# Altium schematic sheet Page 1.SchDoc: Инвертор напряжения 24-380-230В
size 1188 x 840 mm; CompanyName: Nordic Energy; Address1: Address1; Address2: Address2; Address3: Address3; Address4: Address4; DocumentNumber: НЭС.185014.2017-5.1; SheetNumber: 1; SheetTotal: 3; Scale: 1:1; Title2str: номинальной мощностью 2000 Вт; DocumentType: Схема электрическая принципиальная; FirstReferrence: НЭС.185014.2017-5.1
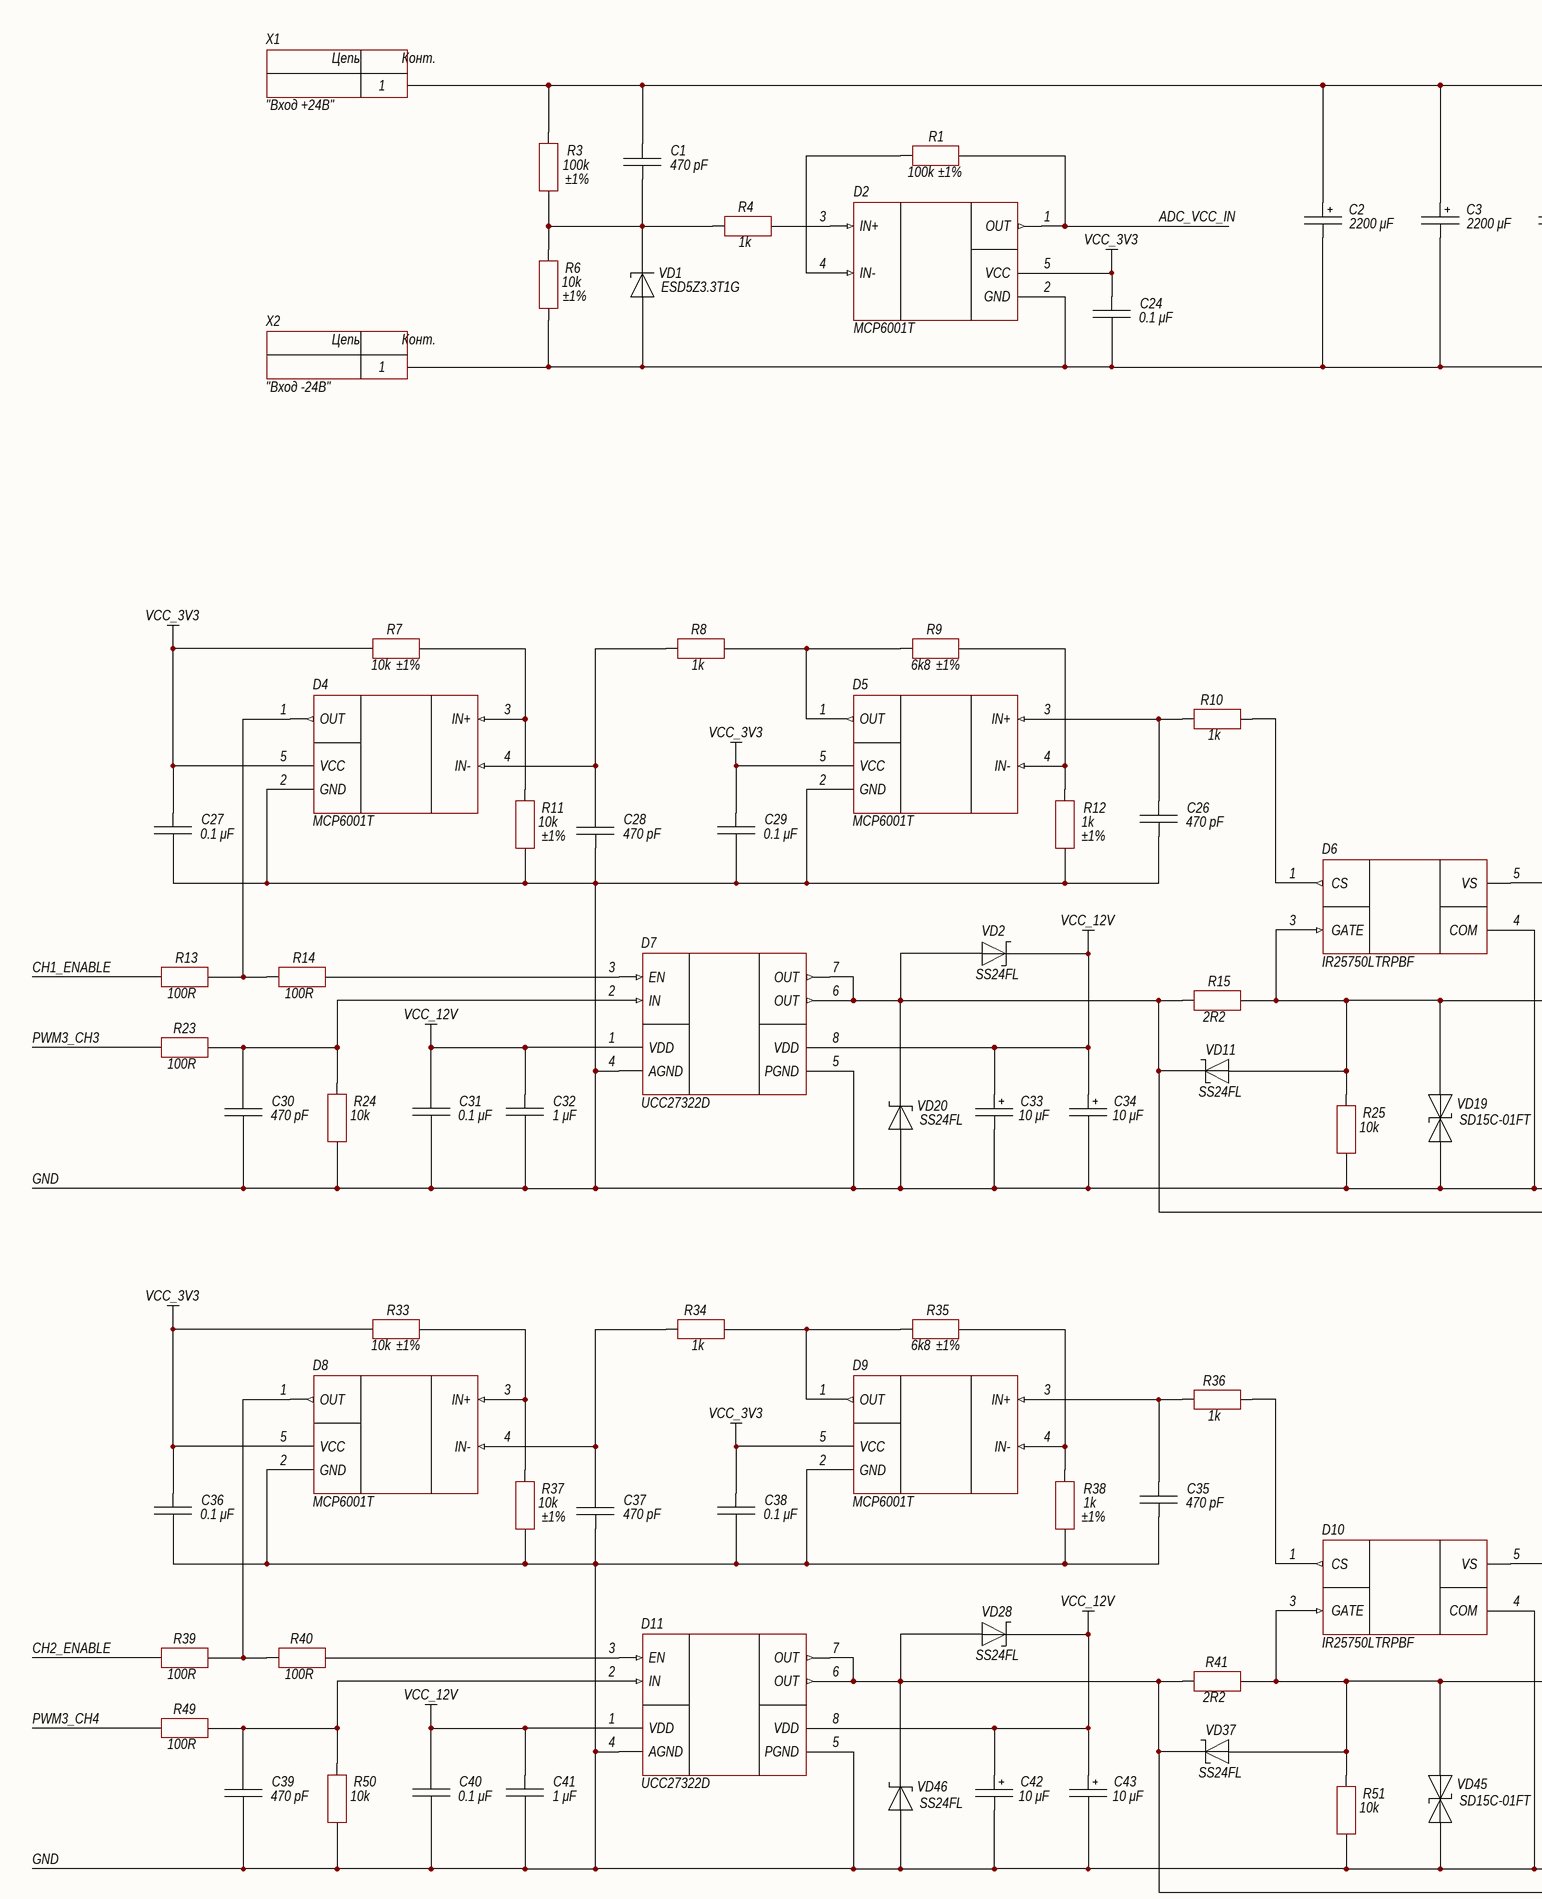
[diagram p0: Page 1.SchDoc, top left]
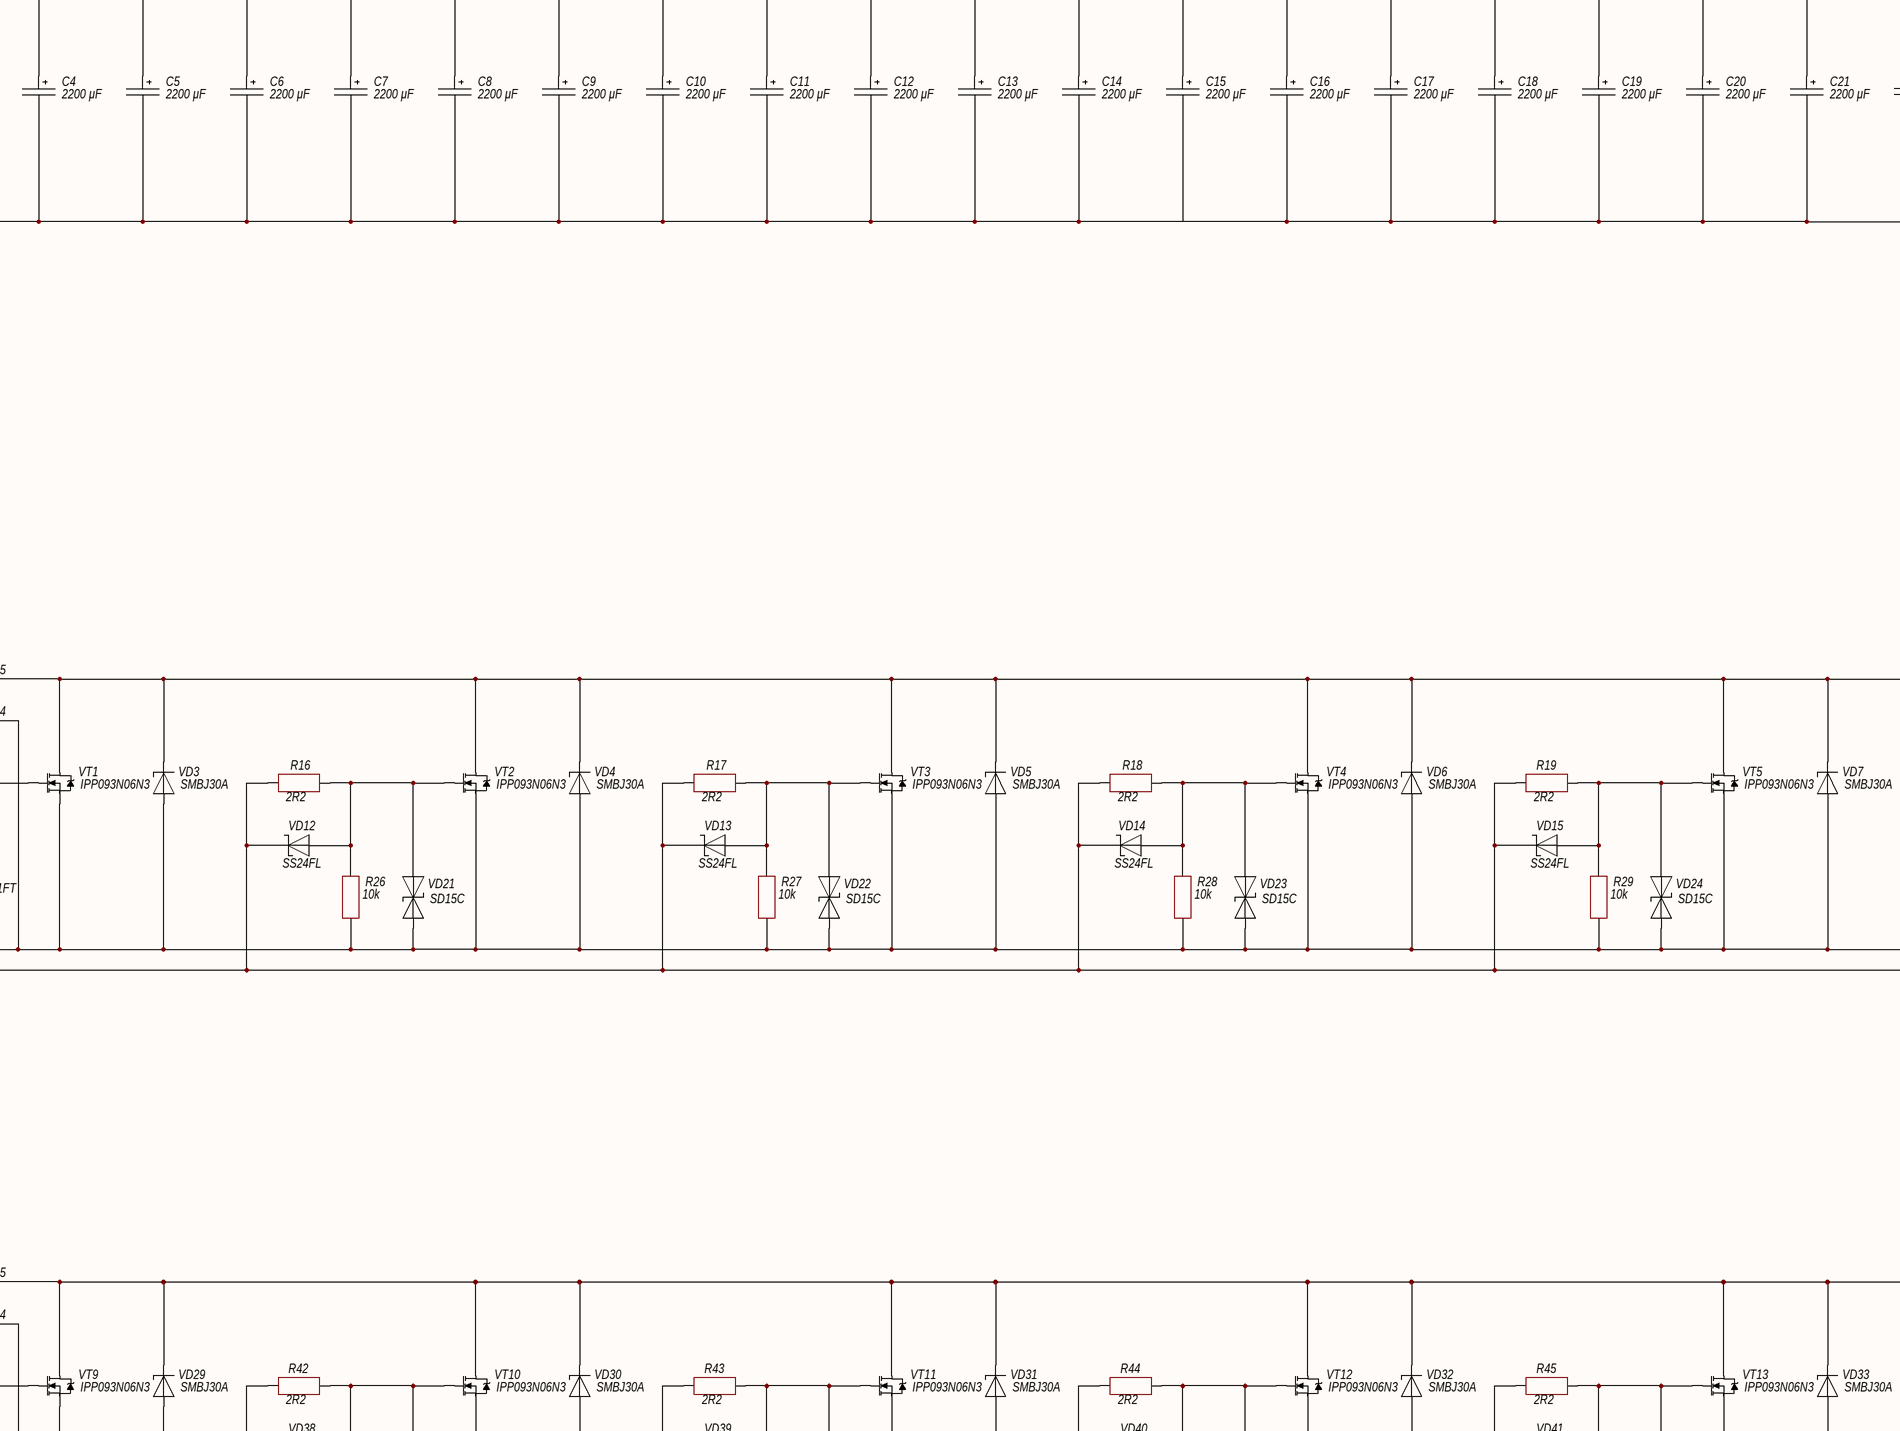
[diagram p1: Page 1.SchDoc, top middle]
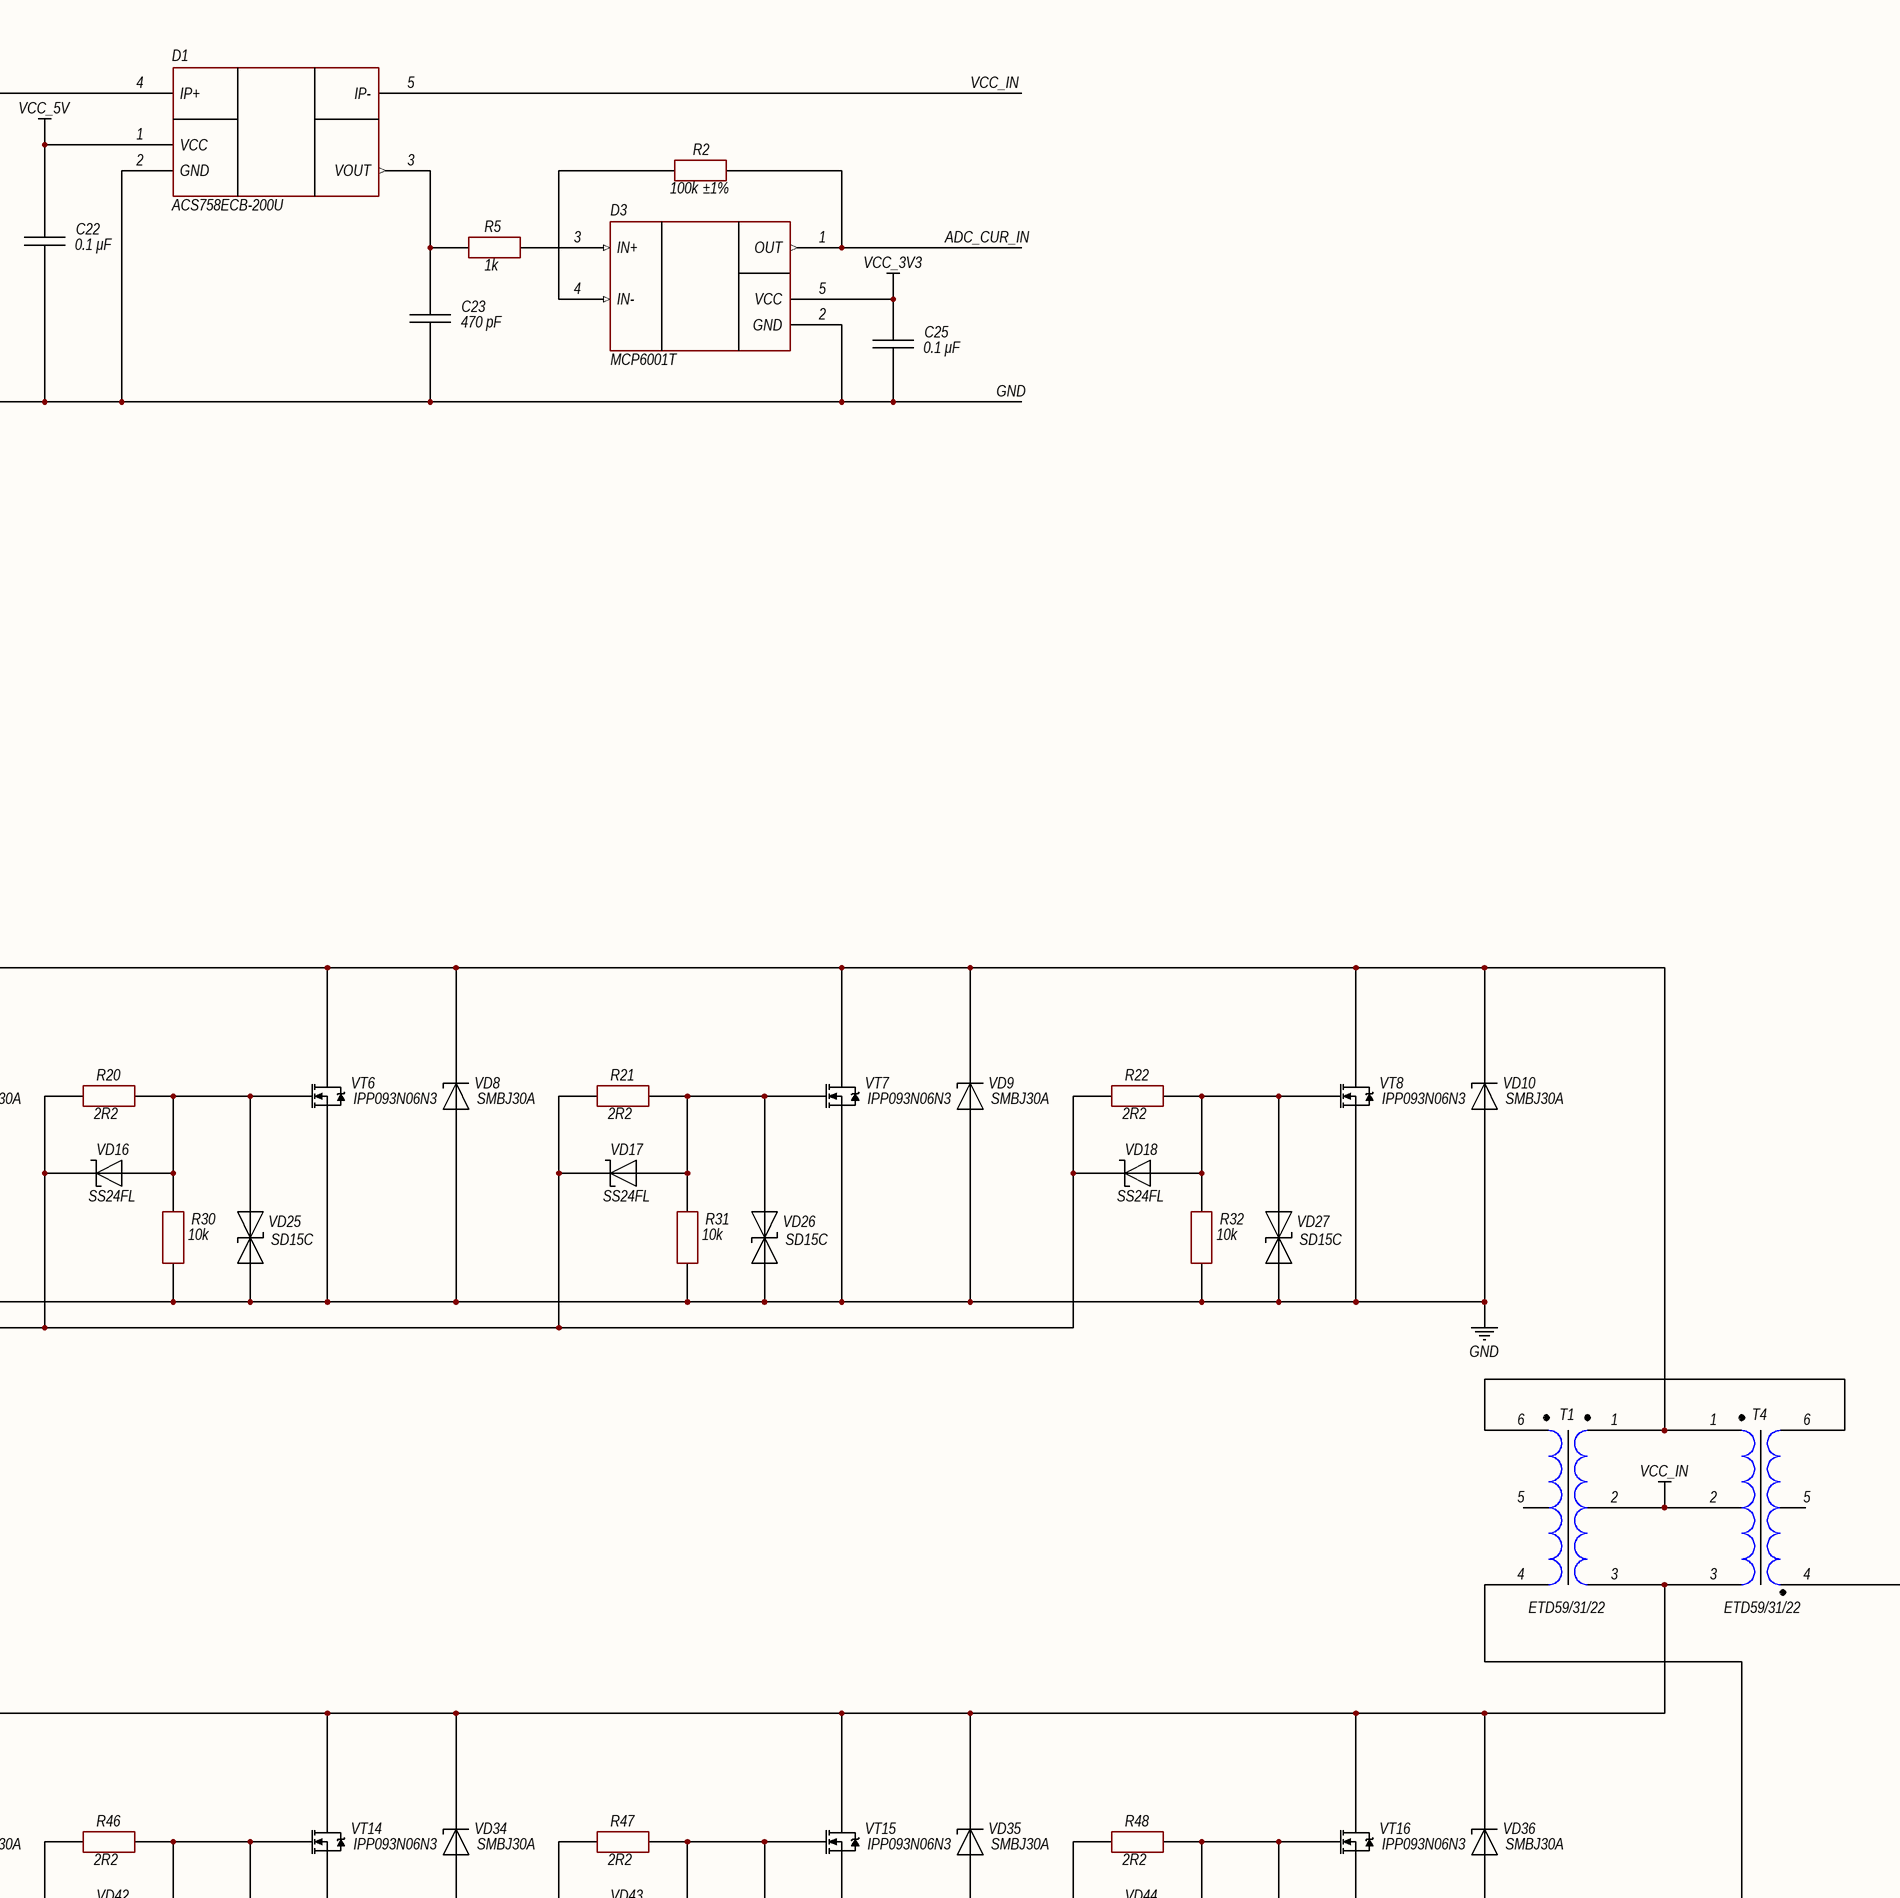
[diagram p2: Page 1.SchDoc, top right]
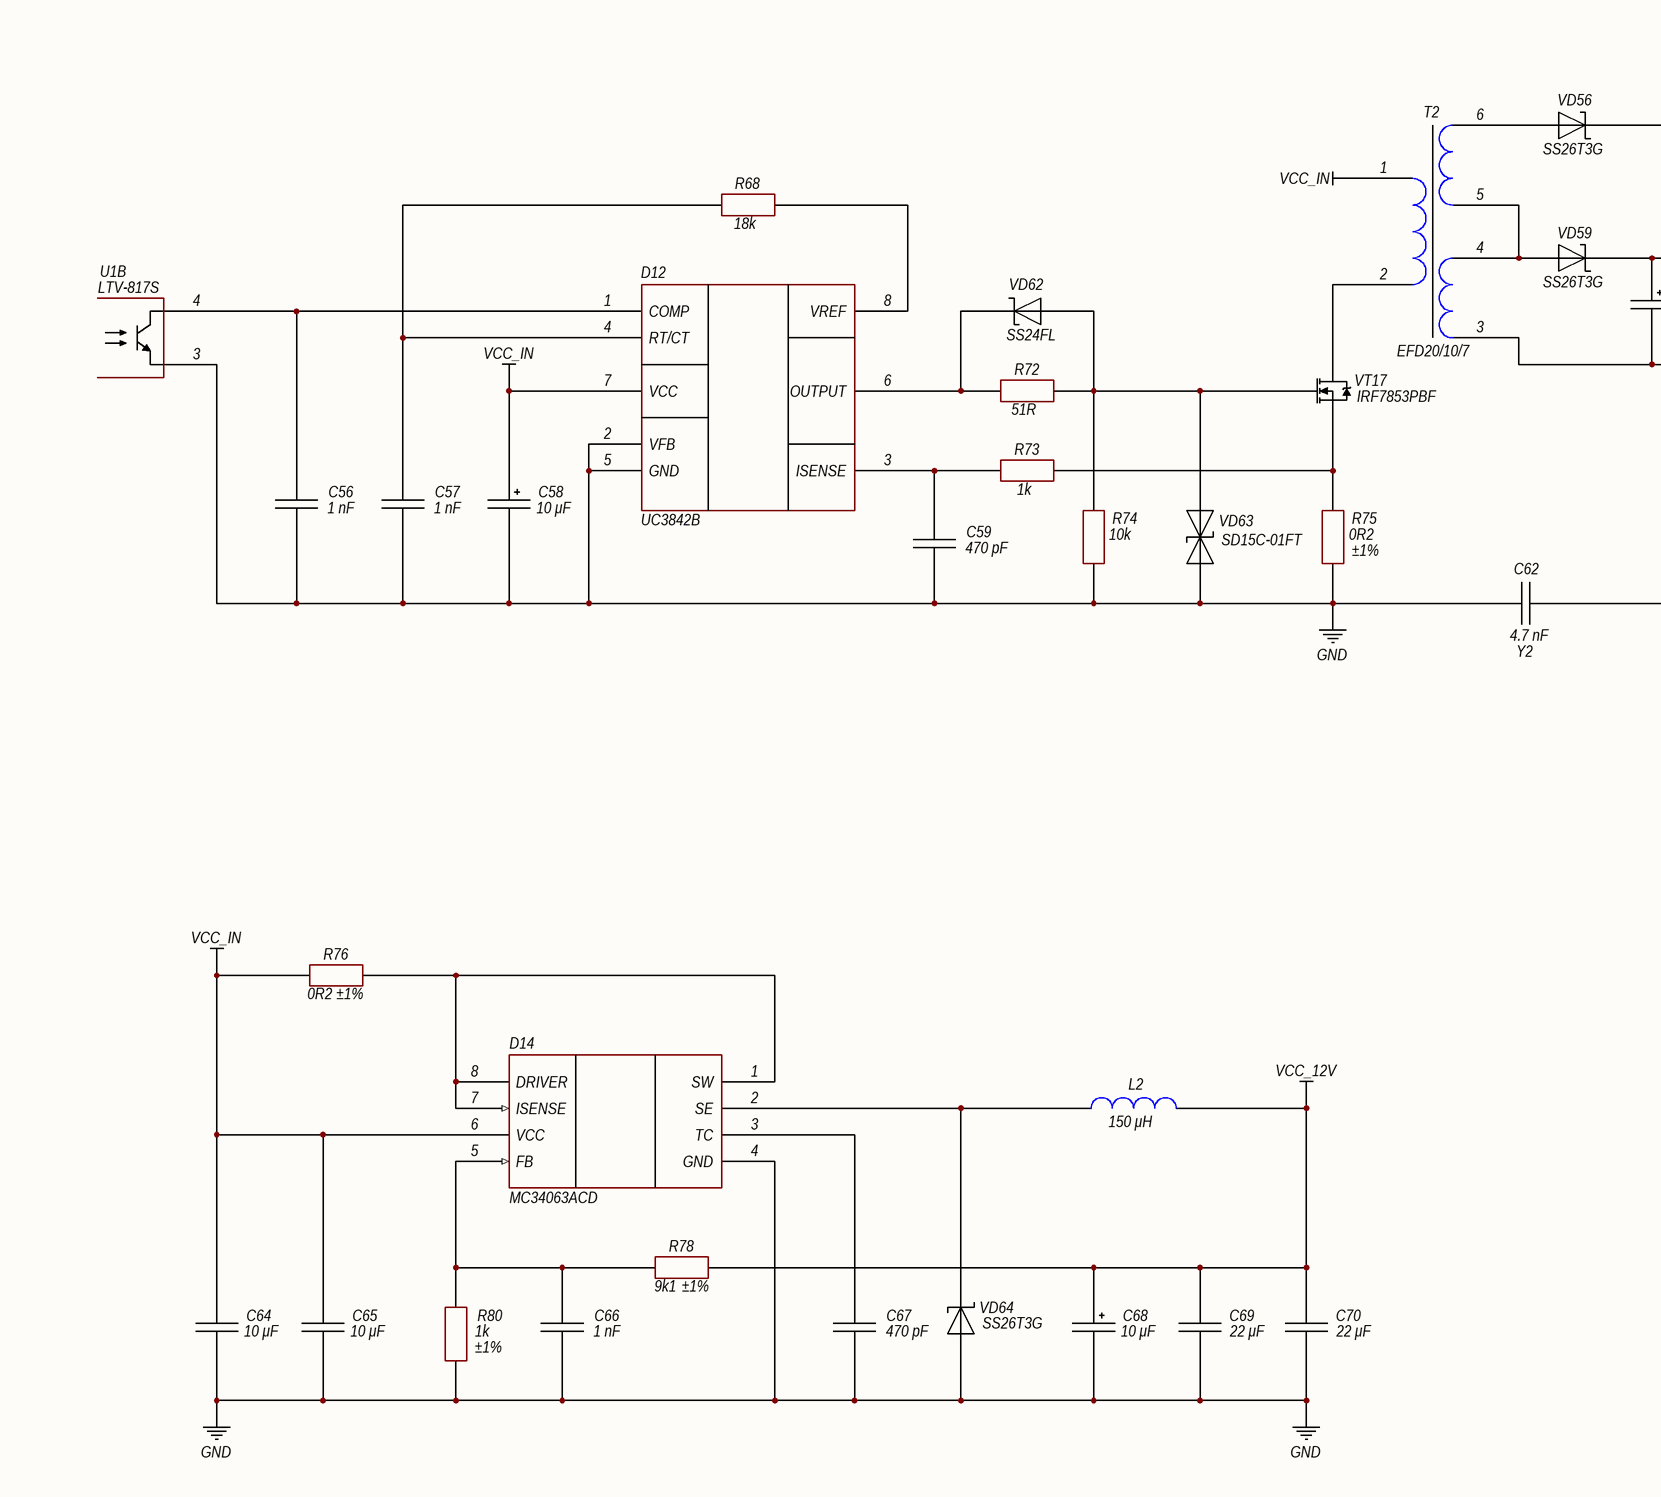
[diagram p3: Page 1.SchDoc, bottom left]
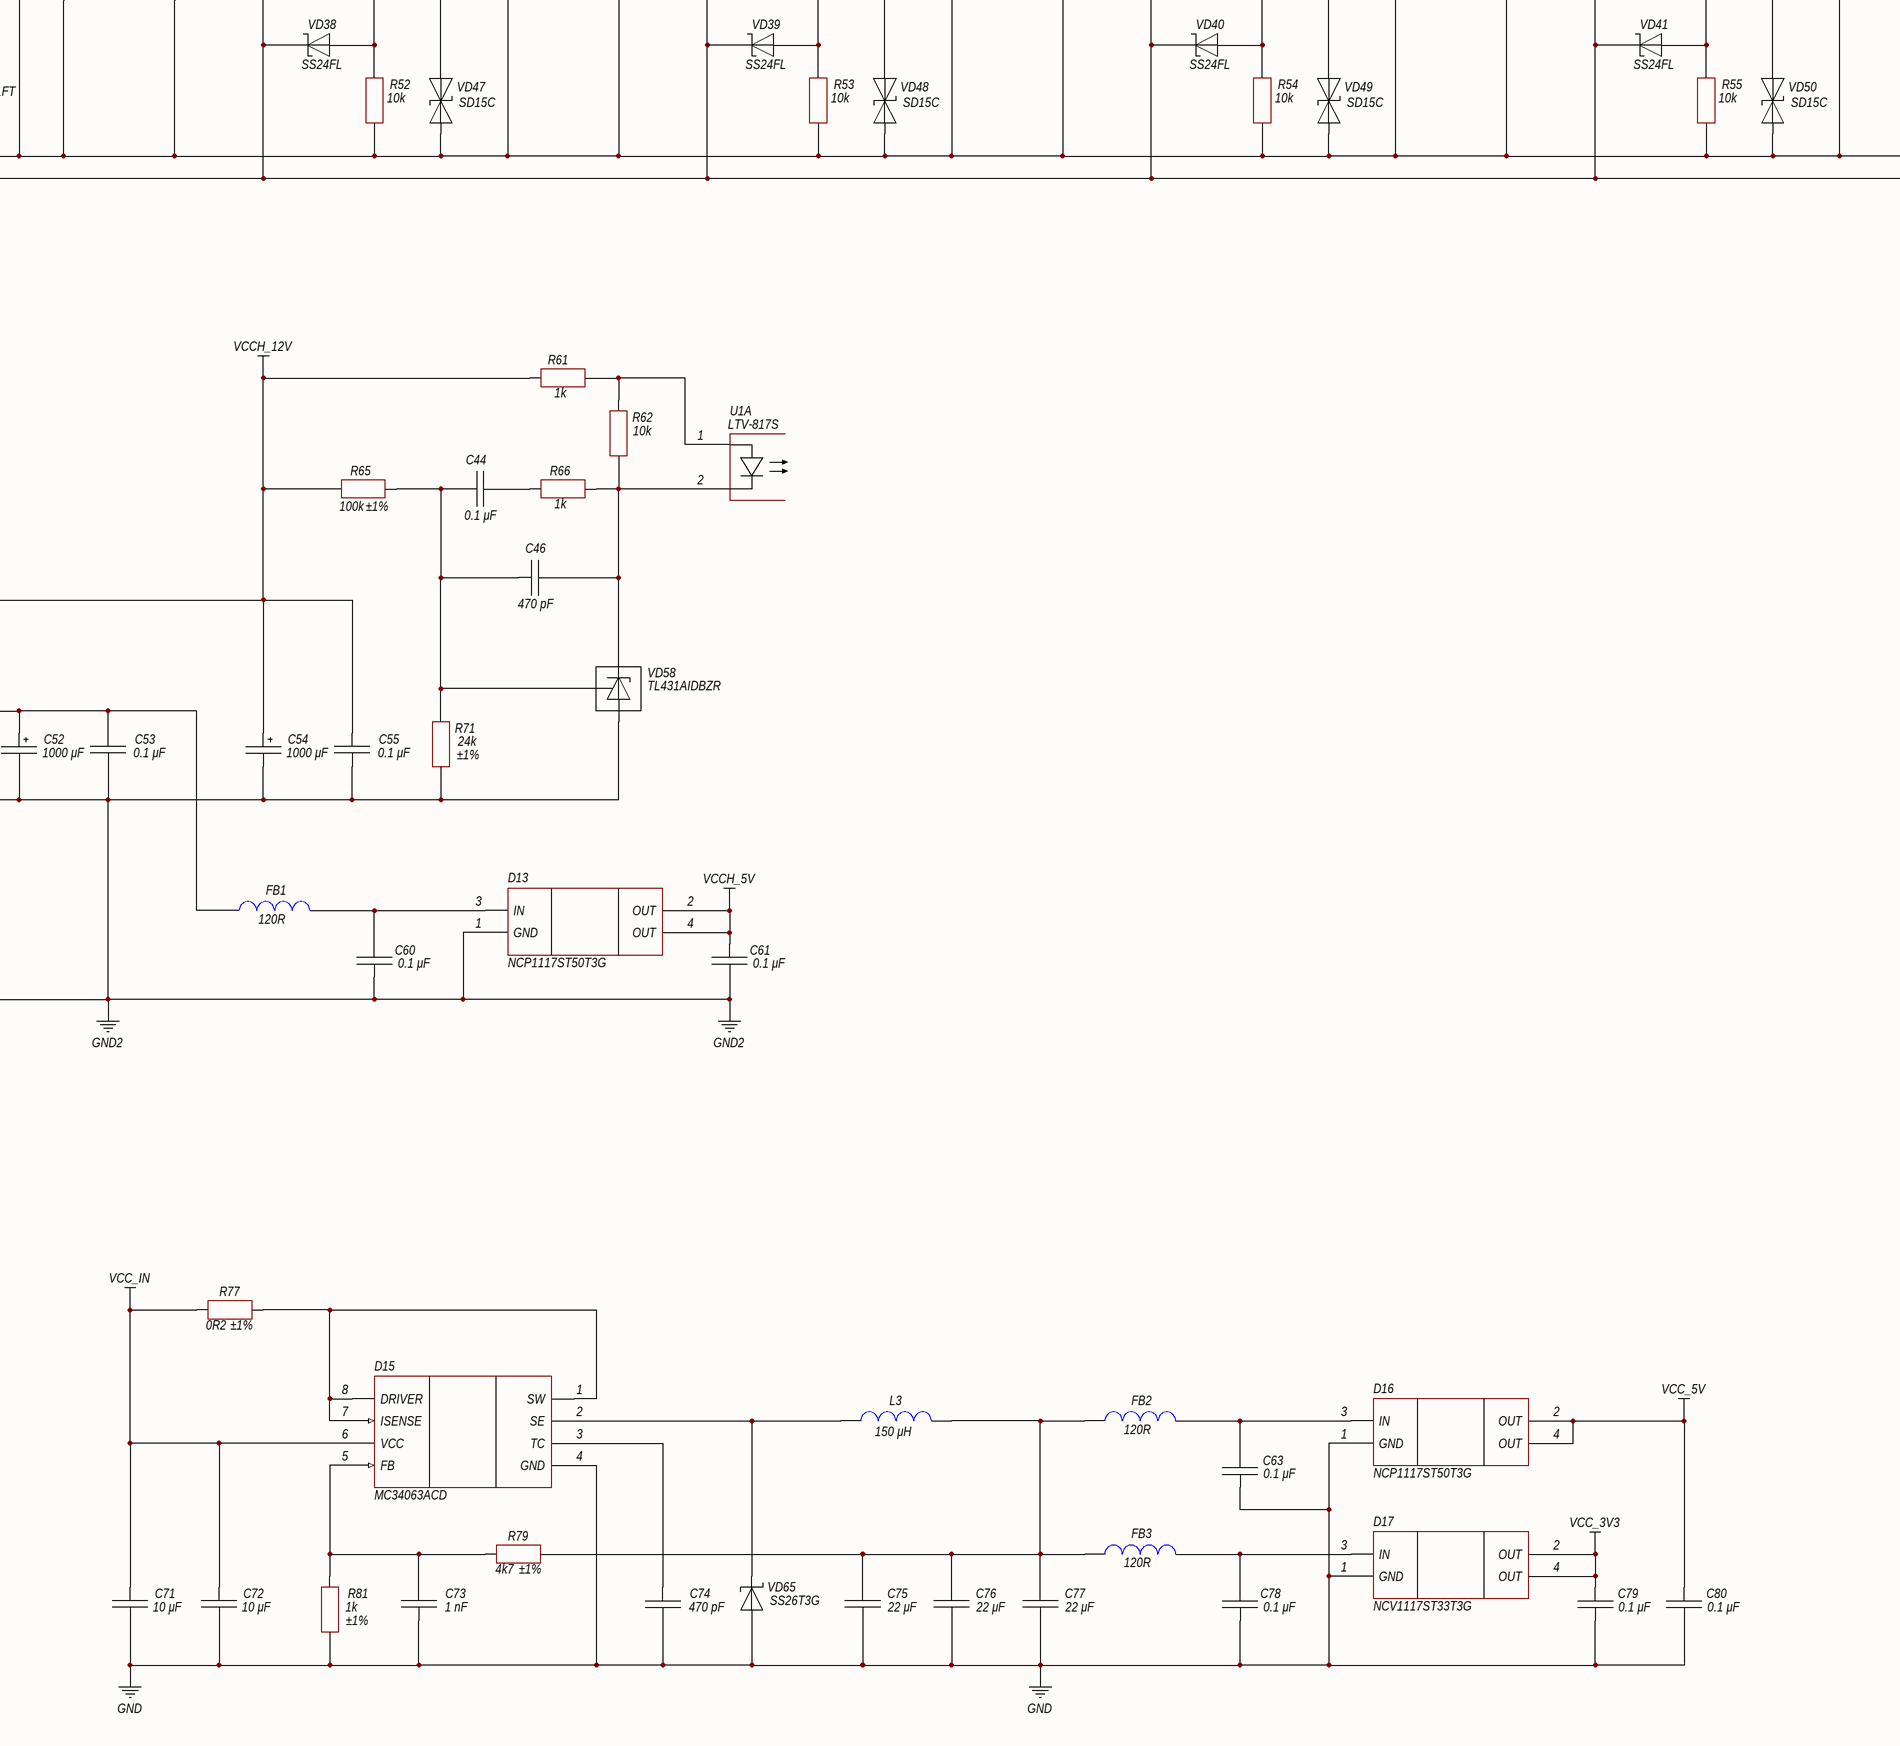
[diagram p4: Page 1.SchDoc, bottom middle]
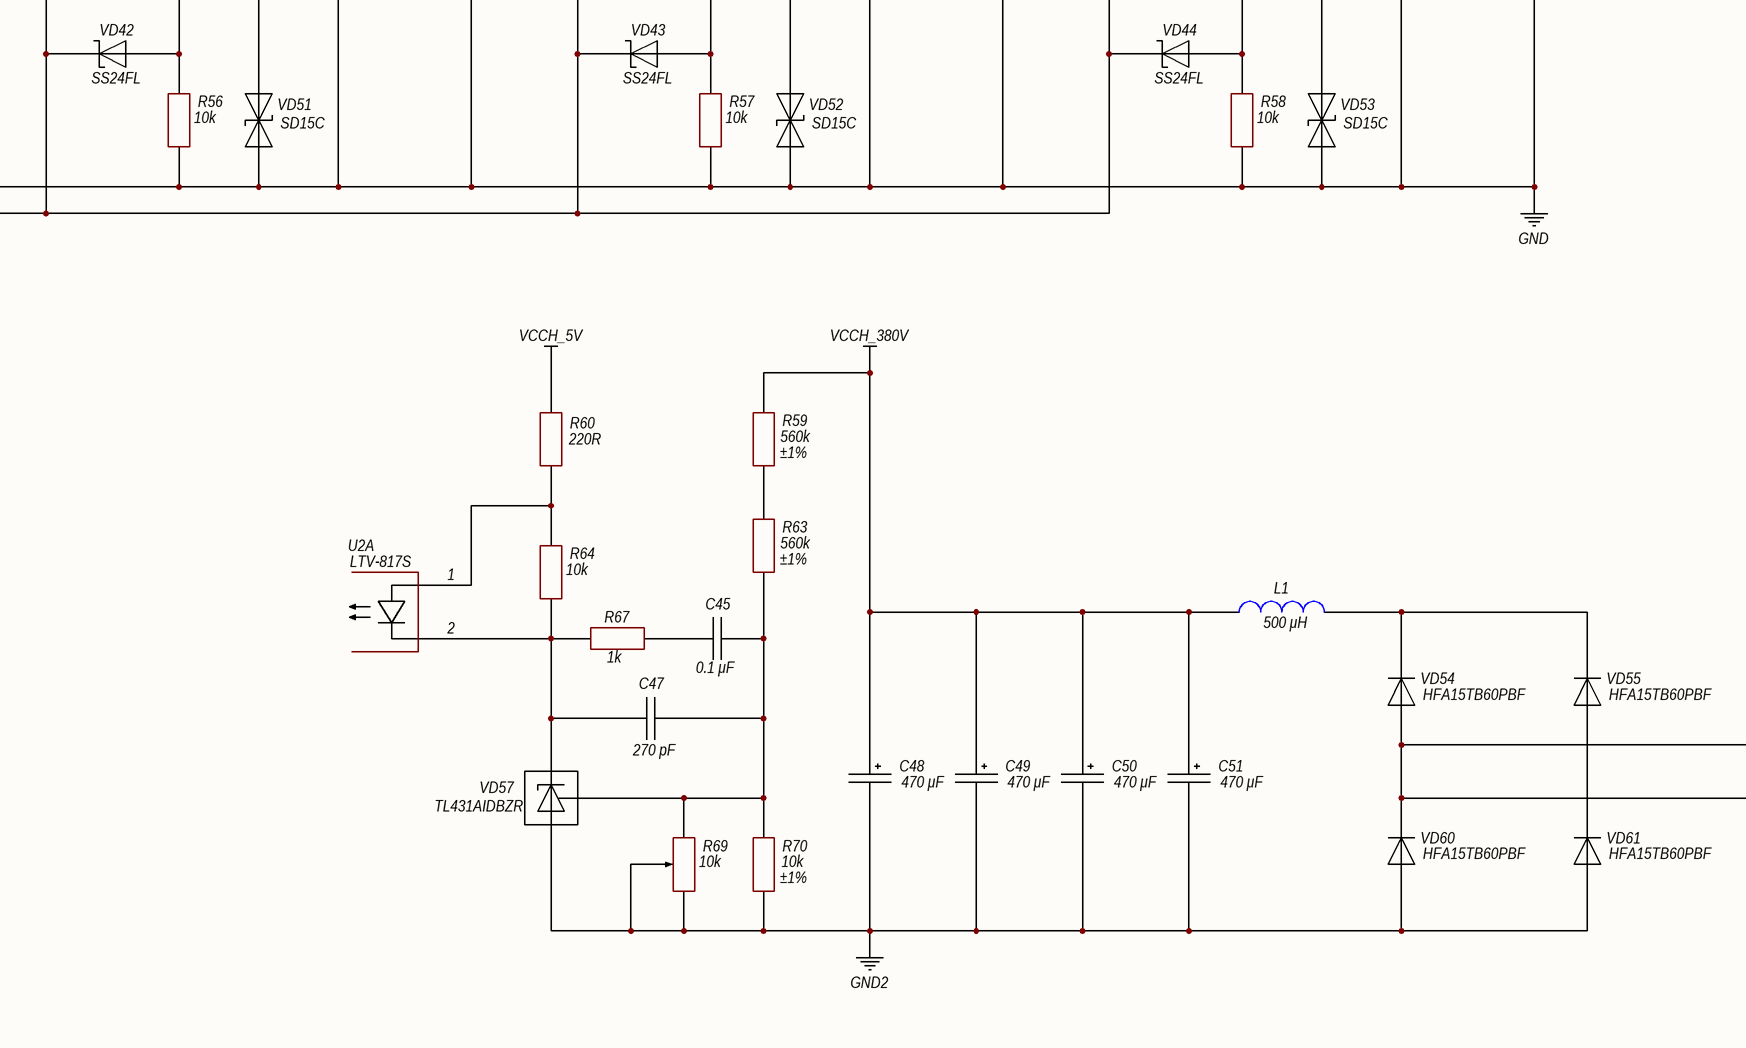
[diagram p5: Page 1.SchDoc, bottom right]

## Parts
C1  470 pF  [CH0805C]
C2  2200 μF  [D16C7.5H25]
C3  2200 μF  [D16C7.5H25]
C4  2200 μF  [D16C7.5H25]
C5  2200 μF  [D16C7.5H25]
C6  2200 μF  [D16C7.5H25]
C7  2200 μF  [D16C7.5H25]
C8  2200 μF  [D16C7.5H25]
C9  2200 μF  [D16C7.5H25]
C10  2200 μF  [D16C7.5H25]
C11  2200 μF  [D16C7.5H25]
C12  2200 μF  [D16C7.5H25]
C13  2200 μF  [D16C7.5H25]
C14  2200 μF  [D16C7.5H25]
C15  2200 μF  [D16C7.5H25]
C16  2200 μF  [D16C7.5H25]
C17  2200 μF  [D16C7.5H25]
C18  2200 μF  [D16C7.5H25]
C19  2200 μF  [D16C7.5H25]
C20  2200 μF  [D16C7.5H25]
C21  2200 μF  [D16C7.5H25]
C22  0.1 μF  [CH0805C]
C23  470 pF  [CH0805C]
C24  0.1 μF  [CH0805C]
C25  0.1 μF  [CH0805C]
C26  470 pF  [CH0805C]
C27  0.1 μF  [CH0805C]
C28  470 pF  [CH0805C]
C29  0.1 μF  [CH0805C]
C30  470 pF  [CH0805C]
C31  0.1 μF  [CH0805C]
C32  1 μF  [CH0805C]
C33  10 μF  [TANTAL_C]
C34  10 μF  [TANTAL_C]
C35  470 pF  [CH0805C]
C36  0.1 μF  [CH0805C]
C37  470 pF  [CH0805C]
C38  0.1 μF  [CH0805C]
C39  470 pF  [CH0805C]
C40  0.1 μF  [CH0805C]
C41  1 μF  [CH0805C]
C42  10 μF  [TANTAL_C]
C43  10 μF  [TANTAL_C]
C44  0.1 μF  [CH0805C]
C45  0.1 μF  [CH0805C]
C46  470 pF  [CH0805C]
C47  270 pF  [CH0805C]
C48  470 μF  [D35C10.5H50]
C49  470 μF  [D35C10.5H50]
C50  470 μF  [D35C10.5H50]
C51  470 μF  [D35C10.5H50]
C52  1000 μF  [D10C5H20]
C53  0.1 μF  [CH0805C]
C54  1000 μF  [D10C5H20]
C55  0.1 μF  [CH0805C]
C56  1 nF  [CH0805C]
C57  1 nF  [CH0805C]
C58  10 μF  [TANTAL_C]
C59  470 pF  [CH0805C]
C60  0.1 μF  [CH0805C]
C61  0.1 μF  [CH0805C]
C62  4.7 nF  ComponentKind: Y2  [CAP: B32021]
C63  0.1 μF  [CH0805C]
C64  10 μF  [CH1206C]
C65  10 μF  [CH1206C]
C66  1 nF  [CH0805C]
C67  470 pF  [CH0805C]
C68  10 μF  [TANTAL_C]
C69  22 μF  [CH1206C]
C70  22 μF  [CH1206C]
C71  10 μF  [CH1206C]
C72  10 μF  [CH1206C]
C73  1 nF  [CH0805C]
C74  470 pF  [CH0805C]
C75  22 μF  [CH1206C]
C76  22 μF  [CH1206C]
C77  22 μF  [CH1206C]
C78  0.1 μF  [CH0805C]
C79  0.1 μF  [CH0805C]
C80  0.1 μF  [CH0805C]
D1  ACS758ECB-200U  [IC: ACS770]
D2  MCP6001T  [SOT23-5]
D3  MCP6001T  [SOT23-5]
D4  MCP6001T  [SOT23-5]
D5  MCP6001T  [SOT23-5]
D6  IR25750LTRPBF  [SOT23-5]
D7  UCC27322D  [8-SOIC]
D8  MCP6001T  [SOT23-5]
D9  MCP6001T  [SOT23-5]
D10  IR25750LTRPBF  [SOT23-5]
D11  UCC27322D  [8-SOIC]
D12  UC3842B  [8-SOIC]
D13  NCP1117ST50T3G  [SOT223]
D14  MC34063ACD  [8-SOIC]
D15  MC34063ACD  [8-SOIC]
D16  NCP1117ST50T3G  [SOT223]
D17  NCV1117ST33T3G  [SOT223]
FB1  120R  [CH0805L]
FB2  120R  [CH0805L]
FB3  120R  [CH0805L]
L1  500 μH  [IND: R46]
L2  150 μH  [IND: B82477G4]
L3  150 μH  [IND: B82477G4]
R1  100k  ComponentKind: ±1%  [CH0805R]
R2  100k  ComponentKind: ±1%  [CH0805R]
R3  100k  ComponentKind: ±1%  [CH0805R]
R4  1k  [CH0805R]
R5  1k  [CH0805R]
R6  10k  ComponentKind: ±1%  [CH0805R]
R7  10k  ComponentKind: ±1%  [CH0805R]
R8  1k  [CH0805R]
R9  6k8  ComponentKind: ±1%  [CH0805R]
R10  1k  [CH0805R]
R11  10k  ComponentKind: ±1%  [CH0805R]
R12  1k  ComponentKind: ±1%  [CH0805R]
R13  100R  [CH0805R]
R14  100R  [CH0805R]
R15  2R2  [CH0805R]
R16  2R2  [CH0805R]
R17  2R2  [CH0805R]
R18  2R2  [CH0805R]
R19  2R2  [CH0805R]
R20  2R2  [CH0805R]
R21  2R2  [CH0805R]
R22  2R2  [CH0805R]
R23  100R  [CH0805R]
R24  10k  [CH0805R]
R25  10k  [CH0805R]
R26  10k  [CH0805R]
R27  10k  [CH0805R]
R28  10k  [CH0805R]
R29  10k  [CH0805R]
R30  10k  [CH0805R]
R31  10k  [CH0805R]
R32  10k  [CH0805R]
R33  10k  ComponentKind: ±1%  [CH0805R]
R34  1k  [CH0805R]
R35  6k8  ComponentKind: ±1%  [CH0805R]
R36  1k  [CH0805R]
R37  10k  ComponentKind: ±1%  [CH0805R]
R38  1k  ComponentKind: ±1%  [CH0805R]
R39  100R  [CH0805R]
R40  100R  [CH0805R]
R41  2R2  [CH0805R]
R42  2R2  [CH0805R]
R43  2R2  [CH0805R]
R44  2R2  [CH0805R]
R45  2R2  [CH0805R]
R46  2R2  [CH0805R]
R47  2R2  [CH0805R]
R48  2R2  [CH0805R]
R49  100R  [CH0805R]
R50  10k  [CH0805R]
R51  10k  [CH0805R]
R52  10k  [CH0805R]
R53  10k  [CH0805R]
R54  10k  [CH0805R]
R55  10k  [CH0805R]
R56  10k  [CH0805R]
R57  10k  [CH0805R]
R58  10k  [CH0805R]
R59  560k  ComponentKind: ±1%  [CH0805R]
R60  220R  [CH0805R]
R61  1k  [CH0805R]
R62  10k  [CH0805R]
R63  560k  ComponentKind: ±1%  [CH0805R]
R64  10k  [CH0805R]
R65  100k  ComponentKind: ±1%  [CH0805R]
R66  1k  [CH0805R]
R67  1k  [CH0805R]
R68  18k  [CH0805R]
R69  10k  [RES: 3296W]
R70  10k  ComponentKind: ±1%  [CH0805R]
R71  24k  ComponentKind: ±1%  [CH0805R]
R72  51R  [CH0805R]
R73  1k  [CH0805R]
R74  10k  [CH0805R]
R75  0R2  ComponentKind: ±1%  [CH1206R]
R76  0R2  ComponentKind: ±1%  [CH1206R]
R77  0R2  ComponentKind: ±1%  [CH1206R]
R78  9k1  ComponentKind: ±1%  [CH0805R]
R79  4k7  ComponentKind: ±1%  [CH0805R]
R80  1k  ComponentKind: ±1%  [CH0805R]
R81  1k  ComponentKind: ±1%  [CH0805R]
T1  ETD59/31/22  [TRANS: ETD59/31/22]
T2  EFD20/10/7  [TRANS: EFD20/10/7]
T4  ETD59/31/22  [TRANS: ETD59/31/22]
U1  LTV-817S  [4-SMD]  (parts A,B of 2)
U2  LTV-817S  [4-SMD]  (part A of 2)
VD1  ESD5Z3.3T1G  [SOD523]
VD2  SS24FL  [SOD123F]
VD3  SMBJ30A  [SMB]
VD4  SMBJ30A  [SMB]
VD5  SMBJ30A  [SMB]
VD6  SMBJ30A  [SMB]
VD7  SMBJ30A  [SMB]
VD8  SMBJ30A  [SMB]
VD9  SMBJ30A  [SMB]
VD10  SMBJ30A  [SMB]
VD11  SS24FL  [SOD123F]
VD12  SS24FL  [SOD123F]
VD13  SS24FL  [SOD123F]
VD14  SS24FL  [SOD123F]
VD15  SS24FL  [SOD123F]
VD16  SS24FL  [SOD123F]
VD17  SS24FL  [SOD123F]
VD18  SS24FL  [SOD123F]
VD19  SD15C-01FT  [SOD323]
VD20  SS24FL  [SOD123F]
VD21  SD15C  [SOD323]
VD22  SD15C  [SOD323]
VD23  SD15C  [SOD323]
VD24  SD15C  [SOD323]
VD25  SD15C  [SOD323]
VD26  SD15C  [SOD323]
VD27  SD15C  [SOD323]
VD28  SS24FL  [SOD123F]
VD29  SMBJ30A  [SMB]
VD30  SMBJ30A  [SMB]
VD31  SMBJ30A  [SMB]
VD32  SMBJ30A  [SMB]
VD33  SMBJ30A  [SMB]
VD34  SMBJ30A  [SMB]
VD35  SMBJ30A  [SMB]
VD36  SMBJ30A  [SMB]
VD37  SS24FL  [SOD123F]
VD38  SS24FL  [SOD123F]
VD39  SS24FL  [SOD123F]
VD40  SS24FL  [SOD123F]
VD41  SS24FL  [SOD123F]
VD42  SS24FL  [SOD123F]
VD43  SS24FL  [SOD123F]
VD44  SS24FL  [SOD123F]
VD45  SD15C-01FT  [SOD323]
VD46  SS24FL  [SOD123F]
VD47  SD15C  [SOD323]
VD48  SD15C  [SOD323]
VD49  SD15C  [SOD323]
VD50  SD15C  [SOD323]
VD51  SD15C  [SOD323]
VD52  SD15C  [SOD323]
VD53  SD15C  [SOD323]
VD54  HFA15TB60PBF  [TO220-2]
VD55  HFA15TB60PBF  [TO220-2]
VD56  SS26T3G  [SMB]
VD57  TL431AIDBZR  [SOT23_132]
VD58  TL431AIDBZR  [SOT23_132]
VD59  SS26T3G  [SMB]
VD60  HFA15TB60PBF  [TO220-2]
VD61  HFA15TB60PBF  [TO220-2]
VD62  SS24FL  [SOD123F]
VD63  SD15C-01FT  [SOD323]
VD64  SS26T3G  [SMB]
VD65  SS26T3G  [SMB]
VT1  IPP093N06N3  [TO220_123]
VT2  IPP093N06N3  [TO220_123]
VT3  IPP093N06N3  [TO220_123]
VT4  IPP093N06N3  [TO220_123]
VT5  IPP093N06N3  [TO220_123]
VT6  IPP093N06N3  [TO220_123]
VT7  IPP093N06N3  [TO220_123]
VT8  IPP093N06N3  [TO220_123]
VT9  IPP093N06N3  [TO220_123]
VT10  IPP093N06N3  [TO220_123]
VT11  IPP093N06N3  [TO220_123]
VT12  IPP093N06N3  [TO220_123]
VT13  IPP093N06N3  [TO220_123]
VT14  IPP093N06N3  [TO220_123]
VT15  IPP093N06N3  [TO220_123]
VT16  IPP093N06N3  [TO220_123]
VT17  IRF7853PBF  [TRANS: SO-8]
X1  "Вход +24В"  [CON: 7461383]
X2  "Вход -24В"  [CON: 7461383]

## Nets
GND: C2.2 C3.2 C4.2 C5.2 C6.2 C7.2 C8.2 C9.2 C10.2 C11.2 C12.2 C13.2 C14.2 C15.2 C16.2 C17.2 C18.2 C19.2 C20.2 C21.2 C22.1 C23.2 C24.1 C25.1 C26.2 C27.1 C28.2 C29.1 C30.2 C31.1 C32.1 C33.2 C34.2 C35.2 C36.1 C37.2 C38.1 C39.2 C40.1 C41.1 C42.2 C43.2 C56.1 C57.1 C58.2 C59.2 C62.1 C63.1 C64.1 C65.1 C66.1 C67.2 C68.2 C69.1 C70.1 C71.1 C72.1 C73.1 C74.2 C75.1 C76.1 C77.1 C78.1 C79.1 C80.1 D1.2(GND) D2.2(GND) D3.2(GND) D4.2(GND) D5.2(GND) D6.4(COM) D7.4(AGND) D7.5(PGND) D8.2(GND) D9.2(GND) D10.4(COM) D11.4(AGND) D11.5(PGND) D12.2(VFB) D12.5(GND) D14.4(GND) D15.4(GND) D16.1(GND) D17.1(GND) R6.2 R11.2 R12.2 R24.1 R25.1 R26.1 R27.1 R28.1 R29.1 R30.1 R31.1 R32.1 R37.2 R38.2 R50.1 R51.1 R52.1 R53.1 R54.1 R55.1 R56.1 R57.1 R58.1 R74.1 R75.2 R80.2 R81.2 U1.3(E) VD1.1(A) VD3.1(A) VD4.1(A) VD5.1(A) VD6.1(A) VD7.1(A) VD8.1(A) VD9.1(A) VD10.1(A) VD19.1(A) VD20.1 VD21.1(A) VD22.1(A) VD23.1(A) VD24.1(A) VD25.1(A) VD26.1(A) VD27.1(A) VD29.1(A) VD30.1(A) VD31.1(A) VD32.1(A) VD33.1(A) VD34.1(A) VD35.1(A) VD36.1(A) VD45.1(A) VD46.1 VD47.1(A) VD48.1(A) VD49.1(A) VD50.1(A) VD51.1(A) VD52.1(A) VD53.1(A) VD63.1(A) VD64.1 VD65.1 VT1.3(S) VT2.3(S) VT3.3(S) VT4.3(S) VT5.3(S) VT6.3(S) VT7.3(S) VT8.3(S) VT9.3(S) VT10.3(S) VT11.3(S) VT12.3(S) VT13.3(S) VT14.3(S) VT15.3(S) VT16.3(S) X2.1
GND2: C48.2 C49.2 C50.2 C51.2 C52.2 C53.1 C54.2 C55.1 C60.1 C61.1 C62.2 D13.1(GND) R69.1 R69.2 R70.2 R71.2 T2.3 VD57.3 VD58.3 VD60.1 VD61.1
VCC_3V3: C24.2 C25.2 C27.2 C29.2 C36.2 C38.2 C79.2 D2.5(VCC) D3.5(VCC) D4.5(VCC) D5.5(VCC) D8.5(VCC) D9.5(VCC) D17.2(OUT) D17.4(OUT) R7.2 R33.2
VCC_5V: C22.2 C80.2 D1.1(VCC) D16.2(OUT) D16.4(OUT)
VCC_12V: C31.2 C32.2 C33.1 C34.1 C40.2 C41.2 C42.1 C43.1 C68.1 C69.2 C70.2 D7.1(VDD) D7.8(VDD) D11.1(VDD) D11.8(VDD) L2.1 R78.2 VD2.2 VD28.2
VCC_IN: C58.1 C64.2 C65.2 C71.2 C72.2 D1.5(IP-) D12.7(VCC) D14.6(VCC) D15.6(VCC) R76.2 R77.2 T1.2 T2.1 T4.2
VCCH_5V: C61.2 D13.2(OUT) D13.4(OUT) R60.2
VCCH_12V: C54.1 C55.2 R61.2 R65.1 VD56.2
VCCH_380V: C48.1 C49.1 C50.1 C51.1 L1.2 R59.1
ADC_CUR_IN: D3.1(OUT) R2.2
ADC_VCC_IN: D2.1(OUT) R1.2
CH1_ENABLE: R13.2
CH2_ENABLE: R39.2
PWM3_CH3: R23.2
PWM3_CH4: R49.2
NetC1_1: C1.1 C2.1 C3.1 C4.1 C5.1 C6.1 C7.1 C8.1 C9.1 C10.1 C11.1 C12.1 C13.1 C14.1 C15.1 C16.1 C17.1 C18.1 C19.1 C20.1 C21.1 D1.4(IP+) R3.1 X1.1
NetC1_2: C1.2 R3.2 R4.2 R6.1 VD1.2(C)
NetC23_1: C23.1 D1.3(VOUT) R5.2
NetC26_1: C26.1 D5.3(IN+) R10.2
NetC28_1: C28.1 D4.4(IN-) R8.2
NetC30_1: C30.1 D7.2(IN) R23.1 R24.2
NetC35_1: C35.1 D9.3(IN+) R36.2
NetC37_1: C37.1 D8.4(IN-) R34.2
NetC39_1: C39.1 D11.2(IN) R49.1 R50.2
NetC44_1: C44.1 C46.1 R65.2 R71.1 VD58.2
NetC44_2: C44.2 R66.2
NetC45_1: C45.1 C47.1 R63.2 R69.3 R70.1 VD57.2
NetC45_2: C45.2 R67.2
NetC46_2: C46.2 R62.1 R66.1 U1.2(C) VD58.1
NetC47_2: C47.2 R64.1 R67.1 U2.2(C) VD57.1
NetC52_1: C52.1 C53.2 FB1.2 VD59.2
NetC56_2: C56.2 D12.1(COMP) U1.4(C)
NetC57_2: C57.2 D12.4(RT/CT) R68.2
NetC59_1: C59.1 D12.3(ISENSE) R73.1
NetC60_2: C60.2 D13.3(IN) FB1.1
NetC63_2: C63.2 D16.3(IN) FB2.1
NetC66_2: C66.2 D14.5(FB) R78.1 R80.1
NetC67_1: C67.1 D14.3(TC)
NetC73_2: C73.2 D15.5(FB) R79.1 R81.1
NetC74_1: C74.1 D15.3(TC)
NetC75_2: C75.2 C76.2 C77.2 FB2.2 FB3.2 L3.1 R79.2
NetC78_2: C78.2 D17.3(IN) FB3.1
NetD2_3: D2.3(IN+) R4.1
NetD2_4: D2.4(IN-) R1.1
NetD3_3: D3.3(IN+) R5.1
NetD3_4: D3.4(IN-) R2.1
NetD4_1: D4.1(OUT) R13.1 R14.2
NetD4_3: D4.3(IN+) R7.1 R11.1
NetD5_1: D5.1(OUT) R8.1 R9.2
NetD5_4: D5.4(IN-) R9.1 R12.1
NetD6_1: D6.1(CS) R10.1
NetD6_3: D6.3(GATE) R15.1 R25.2 VD11.1 VD19.2(C) VT1.1(G)
NetD6_5: D6.5(VS) T1.1 T4.1 VD3.2(C) VD4.2(C) VD5.2(C) VD6.2(C) VD7.2(C) VD8.2(C) VD9.2(C) VD10.2(C) VT1.2(D) VT2.2(D) VT3.2(D) VT4.2(D) VT5.2(D) VT6.2(D) VT7.2(D) VT8.2(D)
NetD7_3: D7.3(EN) R14.1
NetD7_6: D7.6(OUT) D7.7(OUT) R15.2 R16.2 R17.2 R18.2 R19.2 R20.2 R21.2 R22.2 VD2.1 VD11.2 VD12.2 VD13.2 VD14.2 VD15.2 VD16.2 VD17.2 VD18.2 VD20.2
NetD8_1: D8.1(OUT) R39.1 R40.2
NetD8_3: D8.3(IN+) R33.1 R37.1
NetD9_1: D9.1(OUT) R34.1 R35.2
NetD9_4: D9.4(IN-) R35.1 R38.1
NetD10_1: D10.1(CS) R36.1
NetD10_3: D10.3(GATE) R41.1 R51.2 VD37.1 VD45.2(C) VT9.1(G)
NetD10_5: D10.5(VS) T1.3 T4.3 VD29.2(C) VD30.2(C) VD31.2(C) VD32.2(C) VD33.2(C) VD34.2(C) VD35.2(C) VD36.2(C) VT9.2(D) VT10.2(D) VT11.2(D) VT12.2(D) VT13.2(D) VT14.2(D) VT15.2(D) VT16.2(D)
NetD11_3: D11.3(EN) R40.1
NetD11_6: D11.6(OUT) D11.7(OUT) R41.2 R42.2 R43.2 R44.2 R45.2 R46.2 R47.2 R48.2 VD28.1 VD37.2 VD38.2 VD39.2 VD40.2 VD41.2 VD42.2 VD43.2 VD44.2 VD46.2
NetD12_6: D12.6(OUTPUT) R72.2 VD62.2
NetD12_8: D12.8(VREF) R68.1
NetD14_1: D14.1(SW) D14.7(ISENSE) D14.8(DRIVER) R76.1
NetD14_2: D14.2(SE) L2.2 VD64.2
NetD15_1: D15.1(SW) D15.7(ISENSE) D15.8(DRIVER) R77.1
NetD15_2: D15.2(SE) L3.2 VD65.2
NetL1_1: L1.1 VD54.2 VD55.2
NetR16_1: R16.1 R26.2 VD12.1 VD21.2(C) VT2.1(G)
NetR17_1: R17.1 R27.2 VD13.1 VD22.2(C) VT3.1(G)
NetR18_1: R18.1 R28.2 VD14.1 VD23.2(C) VT4.1(G)
NetR19_1: R19.1 R29.2 VD15.1 VD24.2(C) VT5.1(G)
NetR20_1: R20.1 R30.2 VD16.1 VD25.2(C) VT6.1(G)
NetR21_1: R21.1 R31.2 VD17.1 VD26.2(C) VT7.1(G)
NetR22_1: R22.1 R32.2 VD18.1 VD27.2(C) VT8.1(G)
NetR42_1: R42.1 R52.2 VD38.1 VD47.2(C) VT10.1(G)
NetR43_1: R43.1 R53.2 VD39.1 VD48.2(C) VT11.1(G)
NetR44_1: R44.1 R54.2 VD40.1 VD49.2(C) VT12.1(G)
NetR45_1: R45.1 R55.2 VD41.1 VD50.2(C) VT13.1(G)
NetR46_1: R46.1 R56.2 VD42.1 VD51.2(C) VT14.1(G)
NetR47_1: R47.1 R57.2 VD43.1 VD52.2(C) VT15.1(G)
NetR48_1: R48.1 R58.2 VD44.1 VD53.2(C) VT16.1(G)
NetR59_2: R59.2 R63.1
NetR60_1: R60.1 R64.2 U2.1(A)
NetR61_1: R61.1 R62.2 U1.1(A)
NetR72_1: R72.1 R74.2 VD62.1 VD63.2(C) VT17.1(G)
NetR73_2: R73.2 R75.1 VT17.3(S)
NetT1_4: T1.4 T4.4 VD54.1 VD60.2
NetT1_6: T1.6 T4.6
NetT2_2: T2.2 VT17.2(D)
NetT2_4: T2.4 T2.5 VD59.1
NetT2_6: T2.6 VD56.1
NetVD55_1: VD55.1 VD61.2

Not connected (* = marked no-connect by the designer): T1 5; T4 5

## Notes on the sheet
- Перв. примен.
- Справ. №
- Подп. и дата
- Инв. № дубл.
- Взам. инв. №
- Разраб.
- Изм.
- Лист
- № докум.
- Подп.
- Дата
- Лит.
- Масса
- Масштаб
- Пров.
- Т.контр.
- Листов
- Инв. № подл.
- Утв.
- Н.контр.
- 2.106-A1
- Копировал
- Формат А0
- (in symbol 1-Connector) Цепь; Конт.

## Library data of the parts
C1 C23 C26 C28 C30 C35 C37 C39 C46 C59 C67 C74 = Capacitor: Manufacturer: Yageo; Model: CC0805KRX7R9BB471; HelpURL: https://www.digikey.com/product-detail/en/yageo/CC0805KRX7R9BB471/311-1124-1-ND/303034; ComponentKind: X7R; Value: 470 pF
C2-C21 = AlumCap: Manufacturer: Epcos; Model: B41851F7228M000; HelpURL: https://www.digikey.com/products/en?keywords=B41851F7228M000; ComponentKind: 35V; Value: 2200 μF
C22 C24 C25 C27 C29 C31 C36 C38 C40 C44 C45 C53 C55 C60 C61 C63 C78-C80 = Capacitor: Manufacturer: Yageo; Model: CC0805KRX7R8BB104; HelpURL: https://www.digikey.com/product-detail/en/yageo/CC0805KRX7R8BB104/311-1141-1-ND/303051; ComponentKind: X7R; Value: 0.1 μF
C32 C41 = Capacitor: Manufacturer: Yageo; Model: CC0805KKX7R8BB105; HelpURL: https://www.digikey.com/product-detail/en/yageo/CC0805KKX7R8BB105/311-1456-1-ND/2833762; ComponentKind: X7R; Value: 1 μF
C33 C34 C42 C43 C58 C68 = TantalCap: Manufacturer: Vishay Sprague; Model: TR3C106K025C0300; HelpURL: https://www.digikey.com/product-detail/en/vishay-sprague/TR3C106K025C0300/718-1508-1-ND/1859983; ComponentKind: 25V; Value: 10 μF
C47 = Capacitor: Manufacturer: Yageo; Model: CC0805KRX7R9BB271; HelpURL: https://www.digikey.com/product-detail/en/yageo/CC0805KRX7R9BB271/311-1191-1-ND/372904; ComponentKind: X7R; Value: 270 pF
C48-C51 = AlumCap: Manufacturer: EPCOS; Model: B43305B9687M000; HelpURL: https://www.digikey.com/products/en?keywords=B43305B9687M000; ComponentKind: 400V; Value: 470 μF
C52 C54 = AlumCap: Manufacturer: Epcos; Model: B41851A5108M000; HelpURL: https://www.digikey.com/products/en?keywords=B41851A5108M000; ComponentKind: 25V; Value: 1000 μF
C56 C57 C66 C73 = Capacitor: Manufacturer: Yageo; Model: CC0805KRX7R9BB102; HelpURL: https://www.digikey.com/product-detail/en/yageo/CC0805KRX7R9BB102/311-1127-1-ND/303037; ComponentKind: X7R; Value: 1 nF
C62 = Capacitor: Manufacturer: EPCOS (TDK); Model: B32021A3472M; HelpURL: https://www.digikey.com/product-detail/en/epcos-tdk/B32021A3472M000/495-4082-ND/2045205; Value: 4.7 nF
C64 C65 C71 C72 = Capacitor: Manufacturer: Yageo; Model: CC1206KKX5R9BB106; HelpURL: https://www.digikey.com/product-detail/en/yageo/CC1206KKX5R9BB106/311-3449-1-ND/7164470; ComponentKind: X5R; Value: 10 μF
C69 C70 C75-C77 = Capacitor: Manufacturer: Yageo; Model: CC1206MKX5R7BB226; HelpURL: https://www.digikey.com/product-detail/en/yageo/CC1206MKX5R7BB226/311-1997-1-ND/5195899; ComponentKind: X5R; Value: 22 μF
D1 = ACS770LCB: Sensor; Manufacturer: Allegro MicroSystems, LLC; Model: ACS758ECB-200U-PFF-T; HelpURL: https://www.digikey.com/products/en?keywords=ACS758ECB-200U-PFF-T; ComponentKind: 20 mV/A
D2-D5 D8 D9 = MCP6001T: OP amplifier; Manufacturer: Microchip Technology; Model: MCP6001T-I/OT; HelpURL: https://www.digikey.com/product-detail/en/microchip-technology/MCP6001T-I-OT/MCP6001T-I-OTCT-ND/697158; ComponentKind: SOT23-5
D6 D10 = IR25750LTRPBF: Sensor; Manufacturer: Infineon Technologies; Model: IR25750LTRPBF; ComponentKind: SOT23-5; HelpURL: https://www.digikey.com/product-detail/en/infineon-technologies/IR25750LTRPBF/IR25750LTRPBFCT-ND/4743688
D7 D11 = UCC27322D: Low driver; Manufacturer: Texas Instruments; Model: UCC27322D; HelpURL: https://www.digikey.com/product-detail/en/texas-instruments/UCC37322D/296-13687-5-ND/509719; ComponentKind: 8-SOIC
D12 = UC3842BVD1R2G: AC-DC; Manufacturer: Texas Instruments; Model: UC3842BVD1R2G; HelpURL: https://www.digikey.com/product-detail/en/on-semiconductor/UC3842BVD1R2G/UC3842BVD1R2GOSCT-ND/5802572; ComponentKind: 8-SOIC
D13 D16 D17 = NCP1117LPST50T3G: LDO; Manufacturer: ON Semiconductor; ComponentKind: SOT-223
  D13 D16: Model: NCP1117ST50T3G; HelpURL: https://www.digikey.com/product-detail/en/on-semiconductor/NCP1117ST50T3G/NCP1117ST50T3GOSCT-ND/1967217
  D17: Model: NCV1117ST33T3G; HelpURL: https://www.digikey.com/product-detail/en/on-semiconductor/NCV1117ST33T3G/NCV1117ST33T3GOSCT-ND/2705186
D14 D15 = MC34063ADR: Sensor; Manufacturer: STMicroelectronics; Model: MC34063ACD-TR; HelpURL: https://www.digikey.com/product-detail/en/stmicroelectronics/MC34063ACD-TR/497-7850-1-ND/1883654; ComponentKind: 8-SOIC
FB1-FB3 = Inductor: Manufacturer: Murata Electronics North America; Model: BLM21PG121SN1D; HelpURL: https://www.digikey.com/product-detail/en/murata-electronics-north-america/BLM21PG121SN1D/490-5986-1-ND/3845186; ComponentKind: 0805; Value: 120R
L1 = Inductor ring: Manufacturer: Magnetics; Model: 0077439A7; Value: 500 μH; ComponentKind: 60 μ; HelpURL: http://ferrite.ru/warehouse/r-46-724-118-77439-a7.html
L2 L3 = Inductor: Manufacturer: Epcos; Model: B82477G4154M000; HelpURL: https://www.digikey.com/product-detail/en/epcos-tdk/B82477G4154M000/495-5685-1-ND/4245773; ComponentKind: B82477G4; Value: 150 μH
R1-R3 R65 = Resistor: Manufacturer: Yageo; Model: RC0805FR-07100KL; HelpURL: https://www.digikey.com/product-detail/en/yageo/RC0805FR-07100KL/311-100KCRCT-ND/730491; Value: 100k
R4 R5 R8 R10 R34 R36 R61 R66 R67 R73 = Resistor: Manufacturer: Yageo; Model: RC0805JR-071KL; HelpURL: https://www.digikey.com/product-detail/en/yageo/RC0805JR-071KL/311-1.0KARCT-ND/731165; ComponentKind: 0805; Value: 1k
R6 R7 R11 R33 R37 R70 = Resistor: Manufacturer: Yageo; Model: RC0805FR-0710KL; HelpURL: https://www.digikey.com/product-detail/en/yageo/RC0805FR-0710KL/311-10.0KCRCT-ND/730482; Value: 10k
R9 R35 = Resistor: Manufacturer: Yageo; Model: RC0805FR-076K8L; HelpURL: https://www.digikey.com/product-detail/en/yageo/RC0805FR-076K8L/311-6.80KCRCT-ND/731013; Value: 6k8
R12 R38 R80 R81 = Resistor: Manufacturer: Yageo; Model: RC0805FR-071KL; HelpURL: https://www.digikey.com/product-detail/en/yageo/RC0805FR-071KL/311-1.00KCRCT-ND/730391; Value: 1k
R13 R14 R23 R39 R40 R49 = Resistor: Manufacturer: Yageo; Model: RC0805JR-07100RL; HelpURL: https://www.digikey.com/product-detail/en/yageo/RC0805JR-07100RL/311-100ARCT-ND/731185; ComponentKind: 0805; Value: 100R
R15-R22 R41-R48 = Resistor: Manufacturer: Yageo; Model: RC0805JR-072R2L; HelpURL: https://www.digikey.com/product-detail/en/yageo/RC0805JR-072R2L/311-2.2ARCT-ND/731217; ComponentKind: 0805; Value: 2R2
R24-R32 R50-R58 R62 R64 R74 = Resistor: Manufacturer: Yageo; Model: RC0805JR-0710KL; HelpURL: https://www.digikey.com/product-detail/en/yageo/RC0805JR-0710KL/311-10KARCT-ND/731188; ComponentKind: 0805; Value: 10k
R59 R63 = Resistor: Manufacturer: Yageo; Model: RC0805FR-07560KL; HelpURL: https://www.digikey.com/product-detail/en/yageo/RC0805FR-07560KL/311-560KCRCT-ND/730984; Value: 560k
R60 = Resistor: Manufacturer: Yageo; Model: RC0805JR-07220RL; HelpURL: https://www.digikey.com/product-detail/en/yageo/RC0805JR-07220RL/311-220ARCT-ND/731230; ComponentKind: 0805; Value: 220R
R68 = Resistor: Manufacturer: Yageo; Model: RC0805JR-0718KL; HelpURL: https://www.digikey.com/product-detail/en/yageo/RC0805JR-0718KL/311-18KARCT-ND/731213; ComponentKind: 0805; Value: 18k
R69 = ADJ resistor: Manufacturer: Bourns Inc.; Model: 3296W-1-103LF; HelpURL: https://www.digikey.com/product-detail/en/bourns-inc/3296W-1-103LF/3296W-103LF-ND/1088045; ComponentKind: 3296W; Value: 10k
R71 = Resistor: Manufacturer: Yageo; Model: RC0805FR-0724KL; HelpURL: https://www.digikey.com/product-detail/en/yageo/RC0805FR-0724KL/311-24.0KCRCT-ND/730703; Value: 24k
R72 = Resistor: Manufacturer: Yageo; Model: RC0805JR-0751RL; HelpURL: https://www.digikey.com/product-detail/en/yageo/RC0805JR-0751RL/311-51ARCT-ND/731292; ComponentKind: 0805; Value: 51R
R75-R77 = Resistor: Manufacturer: Yageo; Model: PT1206FR-070R2L; HelpURL: https://www.digikey.com/product-detail/en/yageo/PT1206FR-070R2L/311-0.2ANCT-ND/2178372; Value: 0R2
R78 = Resistor: Manufacturer: Yageo; Model: RC0805FR-079K1L; HelpURL: https://www.digikey.com/product-detail/en/yageo/RC0805FR-079K1L/311-9.10KCRCT-ND/731134; Value: 9k1
R79 = Resistor: Manufacturer: Yageo; Model: RC0805FR-074K7L; HelpURL: https://www.digikey.com/product-detail/en/yageo/RC0805FR-074K7L/311-4.70KCRCT-ND/730876; Value: 4k7
T1 T4 = Push-Pull: Impulse; Manufacturer: Epcos; Model: ETD59/31/22; HelpURL: http://ferrite.ru/warehouse/etd-59-31-22-serdechnik-b66397g0000x187.html; ComponentKind: N87
T2 = Isolator: Impulse; Manufacturer: Ferroxcube; Model: EFD20/10/7; HelpURL: http://ferrite.ru/warehouse/efd20-10-7-karkas1sek10vyv-smd-cphs-efd-20-7-1s-10p.html; ComponentKind: CPHS-EFD20/7-1S-10P
U1 U2 = Optoisolator: Manufacturer: Lite-On Inc.; Model: LTV-817S; HelpURL: https://www.digikey.com/product-detail/en/lite-on-inc/LTV-817S/160-1367-5-ND/385837; ComponentKind: 4-SMD
VD1 = Diod Zener: Manufacturer: ON Semiconductor; ComponentKind: SOD-523; Model: ESD5Z3.3T1G; HelpURL: https://www.digikey.com/product-detail/en/on-semiconductor/ESD5Z3.3T1G/ESD5Z3.3T1GOSCT-ND/1967044
VD2 VD11-VD18 VD20 VD28 VD37-VD44 VD46 VD62 = Diod Schottky: Manufacturer: Fairchild/ON Semiconductor; ComponentKind: SOD-123F; Model: SS24FL; HelpURL: https://www.digikey.com/product-detail/en/fairchild-on-semiconductor/SS24FL/SS24FLCT-ND/5305093
VD3-VD10 VD29-VD36 = Diod Zener: Manufacturer: Fairchild/ON Semiconductor; ComponentKind: SMB; Model: SMBJ30A; HelpURL: https://www.digikey.com/product-detail/en/fairchild-on-semiconductor/SMBJ30A/SMBJ30AFSDKR-ND/2053288
VD19 VD21-VD27 VD45 VD47-VD53 VD63 = TVS-diod: Manufacturer: Littelfuse Inc.; Model: SD15C-01FTG; ComponentKind: SOD-323; HelpURL: https://www.digikey.com/product-detail/en/littelfuse-inc/SD15C-01FTG/F6444CT-ND/5019598
VD54 VD55 VD60 VD61 = Diod: Manufacturer: Infineon Technologies; ComponentKind: TO-220AC; Model: HFA15TB60PBF; HelpURL: https://www.digikey.com/product-detail/en/infineon-technologies/HFA15TB60PBF/IRHFA15TB60PBF-ND/5180758
VD56 VD59 VD64 VD65 = Diod Schottky: Manufacturer: ON Semiconductor; ComponentKind: SMB; Model: SS26T3G; HelpURL: https://www.digikey.com/product-detail/en/on-semiconductor/SS26T3G/SS26T3GOSCT-ND/964639
VD57 VD58 = Program Zener: Manufacturer: Texas Instruments; ComponentKind: SOT-23; Model: TL431AIDBZR; HelpURL: https://www.digikey.com/product-detail/en/texas-instruments/ATL431AIDBZR/296-42083-1-ND/5252836
VT1-VT16 = N-chanel: Mosfet; Manufacturer: Infineon Technologies; Model: IPP093N06N3GXKSA1; ComponentKind: TO-220; HelpURL: https://www.digikey.com/products/en?keywords=IPP093N06N3GXKSA1
VT17 = N-chanel: Mosfet; Manufacturer: Infineon Technologies; Model: IRF7853PBF; ComponentKind: SO-8; HelpURL: https://www.digikey.com/products/en?keywords=IRF7853PBF
X1 X2 = 1-Connector: Manufacturer: Wurth Electronics Inc.; Model: 7461383; HelpURL: https://www.digikey.com/products/en?keywords=7461383; ComponentKind: 160А